# EAGLE design attiny84_3Transistor (EAGLE 7.2.0)
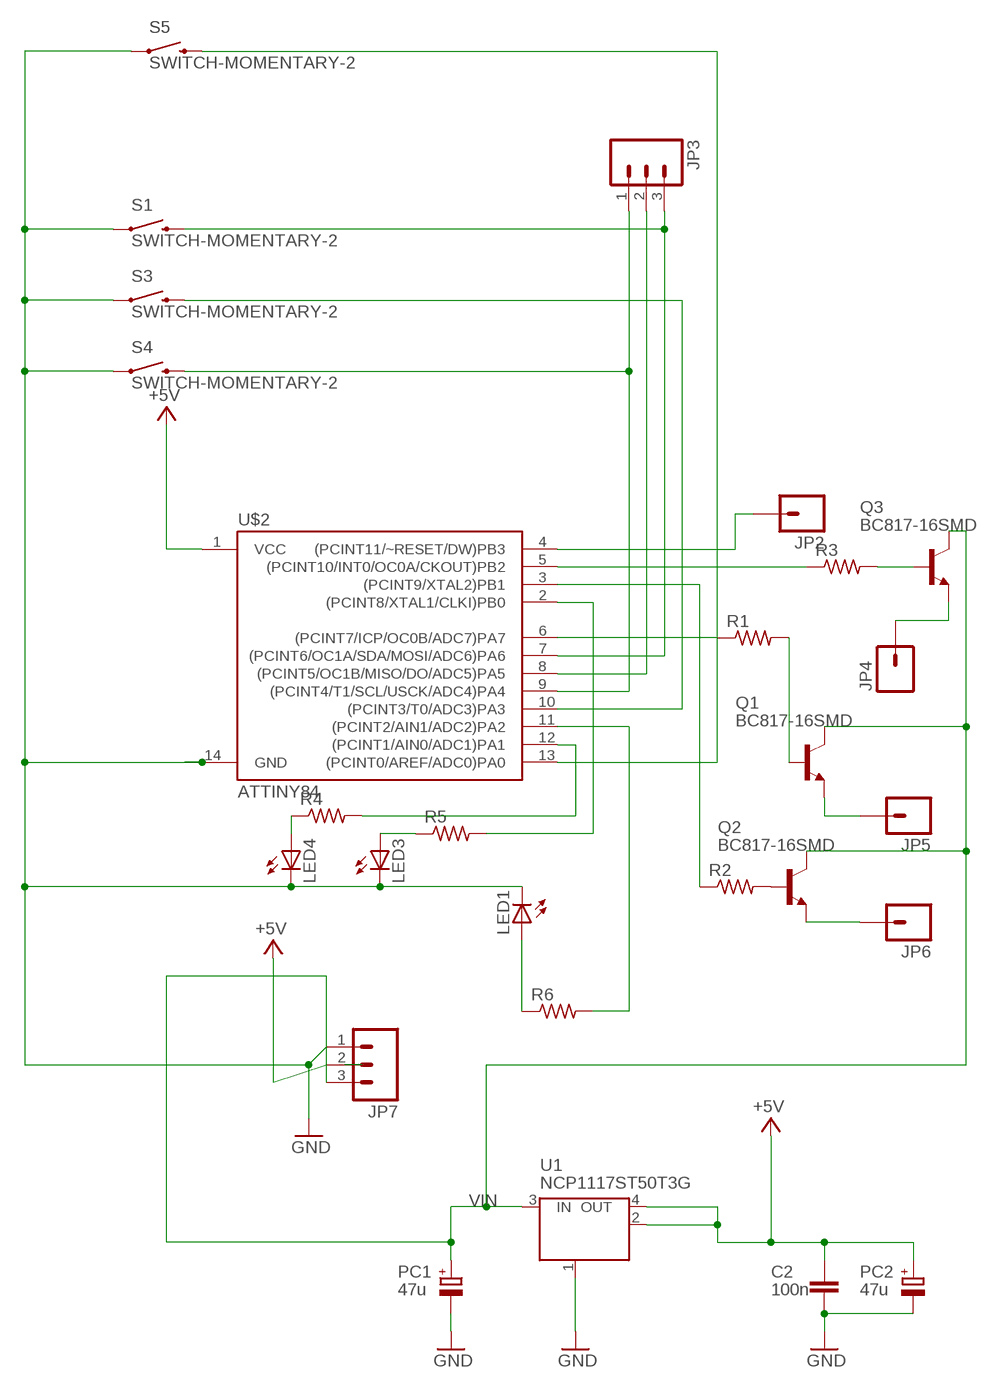
[diagram p0: schematic, sheet 1]

## Parts
C2  100n  C-EU0603-RND  [C0603-ROUND]
JP2  M01NOSILK-KIT  [1X01NS-KIT]
JP3  M031X03_NO_SILK  [1X03_NO_SILK]
JP4  M01NOSILK-KIT  [1X01NS-KIT]
JP5  M01NOSILK-KIT  [1X01NS-KIT]
JP6  M01NOSILK-KIT  [1X01NS-KIT]
JP7  M031X03_NO_SILK  [1X03_NO_SILK]
LED1  LEDCHIPLED_0805  [CHIPLED_0805]
LED3  LEDCHIPLED_0805  [CHIPLED_0805]
LED4  LEDCHIPLED_0805  [CHIPLED_0805]
PC1  47u  CPOL-EUE2.5-5V  [E2,5-4R]
PC2  47u  CPOL-EUE2.5-5V  [E2,5-4R]
Q1  BC817-16SMD  [SOT23-BEC]
Q2  BC817-16SMD  [SOT23-BEC]
Q3  BC817-16SMD  [SOT23-BEC]
R1  R-US_M0805  [M0805]
R2  R-US_M0805  [M0805]
R3  R-US_M0805  [M0805]
R4  R-US_M0805  [M0805]
R5  R-US_M0805  [M0805]
R6  R-US_M0805  [M0805]
S1  SWITCH-MOMENTARY-2  [TACTILE_FSM4JSMATR]
S3  SWITCH-MOMENTARY-2  [TACTILE_FSM4JSMATR]
S4  SWITCH-MOMENTARY-2  [TACTILE_FSM4JSMATR]
S5  SWITCH-MOMENTARY-2  [TACTILE_FSM4JSMATR]
U1  NCP1117ST50T3G  MC33269ST-3.3T3  [SOT223]
U$2  ATTINY84  [SO14]

## Nets
+5V [usbvcc]: C2.2 JP7.2 PC2.+ U1.2(OUT) U1.4(OUT) U$2.1(VCC)
GND: C2.1 JP7.1 LED1.C LED3.C LED4.C PC1.- PC2.- S1.P$1 S1.P$2 S3.P$1 S3.P$2 S4.P$1 S4.P$2 S5.P$1 S5.P$2 U1.1(GND/ADJ) U$2.14(GND)
N$1: JP3.2 U$2.8((PCINT5/OC1B/MISO/DO/ADC5)PA5)
N$2: JP2.1 U$2.4((PCINT11/~RESET/DW)PB3)
N$3: JP3.1 S4.P$3 S4.P$4 U$2.9((PCINT4/T1/SCL/USCK/ADC4)PA4)
N$4: Q1.B R1.2
N$5: JP3.3 S1.P$3 S1.P$4 U$2.7((PCINT6/OC1A/SDA/MOSI/ADC6)PA6)
N$6: Q2.B R2.2
N$7: Q3.B R3.2
N$8: S5.P$3 S5.P$4 U$2.13((PCINT0/AREF/ADC0)PA0)
N$9: R1.1 U$2.6((PCINT7/ICP/OC0B/ADC7)PA7)
N$10: R3.1 U$2.5((PCINT10/INT0/OC0A/CKOUT)PB2)
N$11: R2.1 U$2.3((PCINT9/XTAL2)PB1)
N$12: S3.P$3 S3.P$4 U$2.10((PCINT3/T0/ADC3)PA3)
N$13: R6.2 U$2.11((PCINT2/AIN1/ADC2)PA2)
N$14: JP5.1 Q1.E
N$15: JP4.1 Q3.E
N$17: JP6.1 Q2.E
N$18: R4.2 U$2.12((PCINT1/AIN0/ADC1)PA1)
N$19: R5.2 U$2.2((PCINT8/XTAL1/CLKI)PB0)
N$21: LED4.A R4.1
N$22: LED1.A R6.1
N$24: LED3.A R5.1
VIN [power]: JP7.3 PC1.+ Q1.C Q2.C Q3.C U1.3(IN)

## Library data of the parts
C2 = SmartPrj:C-EU: CAPACITOR, European symbol
JP2 JP4-JP6 = SparkFun-Connectors:M01: Header 1 Standard 1-pin 0.1" header. Use with straight break away headers (SKU : PRT-00116), right angle break away headers (PRT-00553), swiss pins (PRT-00743), machine pins (PRT-00117), and female headers (PRT-00115).
JP3 JP7 = SparkFun-Connectors:M03: Header 3 Standard 3-pin 0.1" header. Use with straight break away headers (SKU : PRT-00116), right angle break away headers (PRT-00553), swiss pins (PRT-00743), machine pins (PRT-00117), and female headers (PRT-00115). Molex polarized connector foot print use with SKU : PRT-08232 with associated crimp pins and housings.
LED1 LED3 LED4 = led:LED: LED OSRAM: - CHIPLED LG R971, LG N971, LY N971, LG Q971, LY Q971, LO R971, LY R971 LH N974, LH R974 LS Q976, LO Q976, LY Q976 LO Q996 - Hyper CHIPLED LW Q18S LB Q993, LB Q99A, LB R99A - SideLED LS A670, LO A670, LY A670, LG A670, LP A670 LB A673, LV A673, LT A673, LW A673 LH A674 LY A675 LS A676, LA A676, LO A676, LY A676, LW A676 LS A679, LY A679, LG A679 - Hyper Micro SIDELED® LS Y876, LA Y876, LO Y876, LY Y876 LT Y87S - SmartLED LW L88C, LW L88S LB L89C, LB L89S, LG L890 LS L89K, LO L89K, LY L89K LS L896, LA L896, LO L896, LY L896 - TOPLED LS T670, LO T670, LY T670, LG T670, LP T670 LSG T670, LSP T670, LSY T670, LOP T670, LYG T670 LG T671, LOG T671, LSG T671 LB T673, LV T673, LT T673, LW T673 LH T674 LS T676, LA T676, LO T676, LY T676, LB T676, LH T676, LSB T676, LW T676 LB T67C, LV T67C, LT T67C, LS T67K, LO T67K, LY T67K, LW E67C LS E67B, LA E67B, LO E67B, LY E67B, LB E67C, LV E67C, LT E67C LW T67C LS T679, LY T679, LG T679 LS T770, LO T770, LY T770, LG T770, LP T770 LB T773, LV T773, LT T773, LW T773 LH T774 LS E675, LA E675, LY E675, LS T675 LS T776, LA T776, LO T776, LY T776, LB T776 LHGB T686 LT T68C, LB T68C - Hyper Mini TOPLED® LB M676 - Mini TOPLED Santana® LG M470 LS M47K, LO M47K, LY M47K Source: http://www.osram.convergy.de LUXEON: - LUMILED® LXK2-PW12-R00, LXK2-PW12-S00, LXK2-PW14-U00, LXK2-PW14-V00 LXK2-PM12-R00, LXK2-PM12-S00, LXK2-PM14-U00 LXK2-PE12-Q00, LXK2-PE12-R00, LXK2-PE12-S00, LXK2-PE14-T00, LXK2-PE14-U00 LXK2-PB12-K00, LXK2-PB12-L00, LXK2-PB12-M00, LXK2-PB14-N00, LXK2-PB14-P00, LXK2-PB14-Q00 LXK2-PR12-L00, LXK2-PR12-M00, LXK2-PR14-Q00, LXK2-PR14-R00 LXK2-PD12-Q00, LXK2-PD12-R00, LXK2-PD12-S00 LXK2-PH12-R00, LXK2-PH12-S00 LXK2-PL12-P00, LXK2-PL12-Q00, LXK2-PL12-R00 Source: www.luxeon.com KINGBRIGHT: KA-3528ASYC Source: www.kingbright.com
PC1 PC2 = rcl:CPOL-EU: POLARIZED CAPACITOR, European symbol
Q1-Q3 = transistor-npn:BC817*: NPN Transistor
R1-R6 = adafruit:R-US_: RESISTOR, American symbol
S1 S3-S5 = SparkFun-Electromechanical_alr:SWITCH-MOMENTARY-2: Various NO switches- pushbuttons, reed, etc
U1 = linear:MC33269ST*: Adjustable Output Low Dropout Voltage Regulator 800 mA Source: http://www.onsemi.com/pub/Collateral/MC33269-D.PDF
U$2 = SparkFun-DigitalIC:ATTINY84: Atmel 14-pin 2/4/8kB flash uC; PROD_ID: IC-11285

## Net classes
1 power: width 0.61 mm, drill 0.61 mm, clearance 0.254 mm
2 gnd: width 0.305 mm, drill 0.559 mm, clearance 0.254 mm
3 usbvcc: width 0.508 mm, drill 0.61 mm, clearance 0.254 mm

## Board
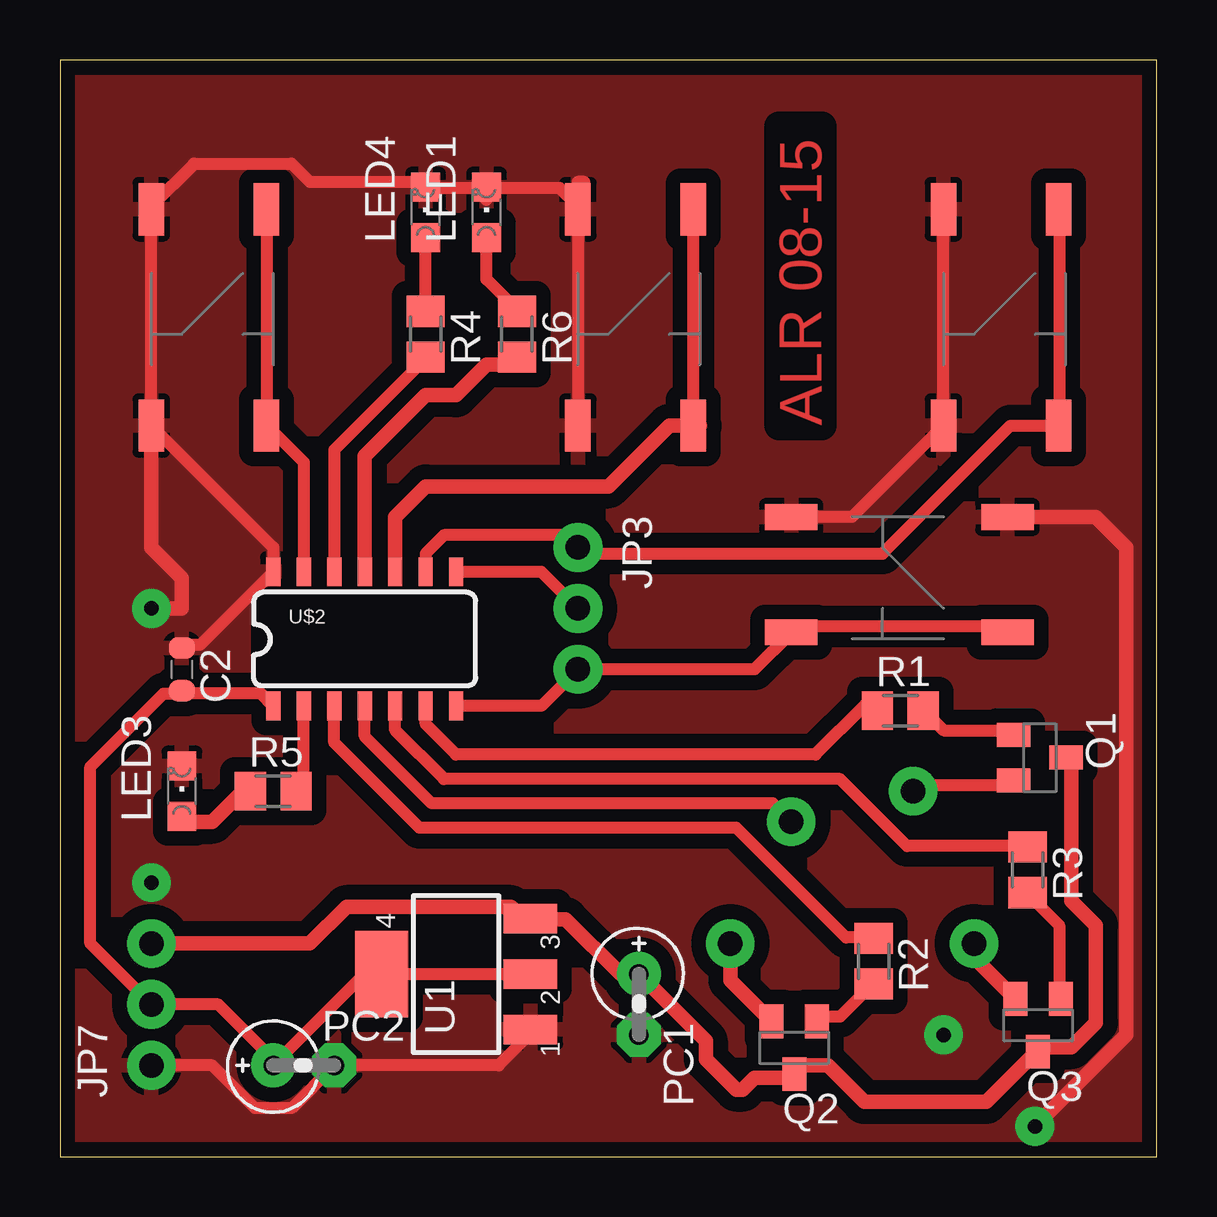
[diagram p1: board, top side]
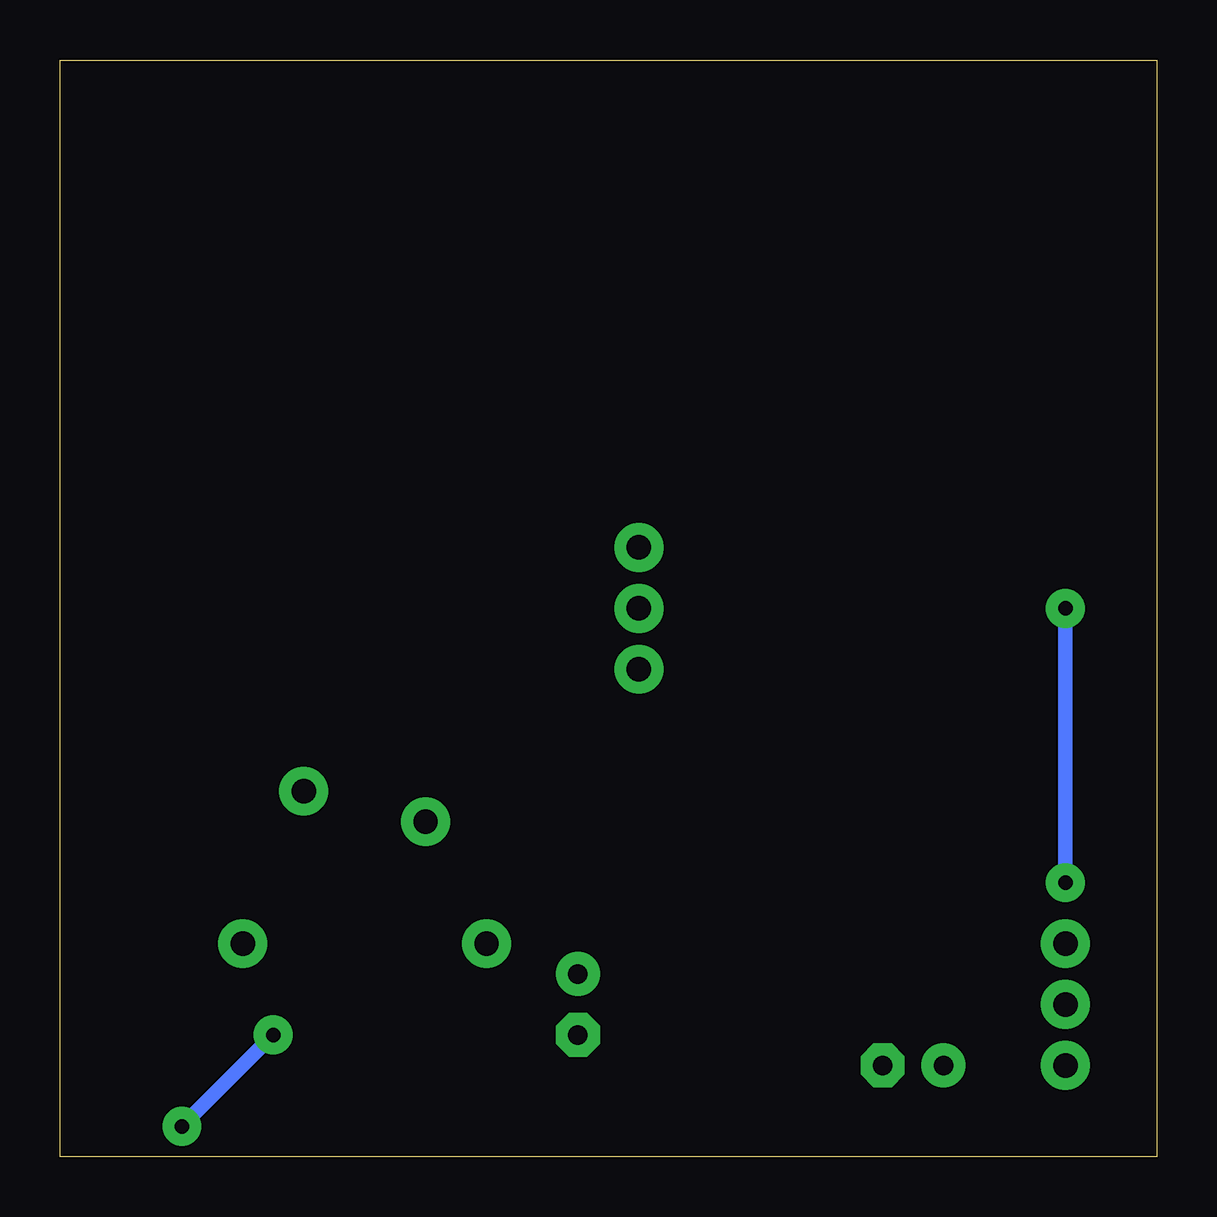
[diagram p2: board, bottom side, seen from below]

Size 45.72 x 45.72 mm. Coordinates in mm from the lower left corner, seen from the top.
Outline: 0,0 45.72,0 45.72,45.72 0,45.72 0,0
Copper layers (1*16): Top 0.035mm / dielectric 1.5mm / Bottom 0.035mm
Design rules "SparkFun2 *": minimum track width 20mil, minimum drill 20mil, track to track 20mil, track to pad 20mil, pad to pad 20mil, via to via 20mil, smd to smd 8mil, copper to edge 10mil, drill to drill 8mil, minimum pad ring 20mil, minimum via ring 20mil, stop-mask expansion 5mil, vias tented up to drill 25mil, thermal gap 10mil
tRestrict: area 8.9,20.3 to 16.5,22.9

### Footprints (pad centres in the part's own frame; a part is rotated, then mirrored left to right if it is on the bottom)
C0603-ROUND = smd 0.898 x 1.1: 1 -0.889,0; 2 0.889,0
1X01NS-KIT = drill 1.016 pad 1.88: 1 0,0
1X03_NO_SILK = drill 1.016 pad 1.88: 1 0,0; 2 2.54,0; 3 5.08,0
CHIPLED_0805 = smd 1.2 x 1.2: A 0,-1.05; C 0,1.05
E2,5-4R = drill 0.813 pad 1.6: + -1.27,0 | drill 0.813 pad 1.6 octagon: - 1.27,0
SOT23-BEC = smd 1 x 1.4: B -0.95,-1.1; C 0,1.1; E 0.95,-1.1
M0805 = smd 1.3 x 1.6: 1 -0.95,0; 2 0.95,0
TACTILE_FSM4JSMATR = smd 1.067 x 2.184: P$1 0,0; P$2 0,9.017; P$3 4.801,9.017; P$4 4.801,0
SOT223 = smd 1.219 x 2.235: 1 -2.311,-3.099; 2 0,-3.099; 3 2.311,-3.099 | smd 3.6 x 2.2: 4 0,3.099
SO14 = smd 0.6 x 1.2: 1 -3.81,-2.8; 2 -2.54,-2.8; 3 -1.27,-2.8; 4 0,-2.8; 5 1.27,-2.8; 6 2.54,-2.8; 7 3.81,-2.8; 8 3.81,2.8; 9 2.54,2.8; 10 1.27,2.8; 11 0,2.8; 12 -1.27,2.8; 13 -2.54,2.8; 14 -3.81,2.8

### Placement (x,y rotation side)
C2  5.08,20.32 270 top
JP2  30.48,13.97 0 top
JP3  21.59,25.4 270 top
JP4  38.1,8.89 0 top
JP5  35.56,15.24 0 top
JP6  27.94,8.89 0 top
JP7  3.81,3.81 90 top
LED1  17.78,39.37 0 top
LED3  5.08,15.24 0 top
LED4  15.24,39.37 0 top
PC1  24.13,6.35 270 top
PC2  10.16,3.81 0 top
Q1  40.84,16.64 270 top
Q2  30.61,4.55 180 top
Q3  40.77,5.49 180 top
R1  35.03,18.59 0 top
R2  33.91,8.15 270 top
R3  40.34,11.96 270 top
R4  15.24,34.29 270 top
R5  8.89,15.24 0 top
R6  19.05,34.29 270 top
S1  30.48,26.67 270 top
S3  21.59,30.48 0 top
S4  36.83,30.48 0 top
S5  3.81,30.48 0 top
U1  16.51,7.62 90 top
U$2  12.7,21.59 0 top

### Tracks (layer width: path | path; a pad name or v marks a point on that pad's centre or on a via)
+5V
  Top 0.508: 5.08,19.3 8.38,19.3 U$2.1 | 5.08,19.3 4.32,19.3 1.27,16.26 1.27,8.89 JP7.2 6.6,6.35 8.89,4.06 PC2.+ 12.7,7.62 U1.4 U1.2 | 5.08,19.3 C2.2
GND  (via drill 0.6)
  Top 0.508: S1.P$1 33.02,26.67 S4.P$1 S4.P$2 | 17.78,40.39 15.24,40.39 LED4.C 15.24,40.64 10.41,40.64 9.65,41.4 5.59,41.4 3.81,39.62 S5.P$2 | 17.78,40.39 20.83,40.39 21.59,39.62 S3.P$2 | S3.P$2 S3.P$1 | S5.P$2 S5.P$1 8.89,25.4 U$2.14 5.84,21.34 5.08,21.34 C2.1 | U1.1 19.56,5.08 18.29,3.81 PC2.- 9.65,2.03 8.13,2.03 6.35,3.81 JP7.1 | 17.78,39.88 17.78,40.39 | 17.78,40.39 LED1.C | 21.84,40.64 21.59,40.64 | S3.P$2 21.84,40.39 21.59,40.39 | S5.P$2 4.06,39.62 S5.P$2
  Top 0.61: S5.P$1 3.81,25.4 5.08,24.13 5.08,22.86 v3.81,22.86 | v40.64,1.27 44.45,5.08 44.45,25.4 43.18,26.67 S1.P$2 39.37,26.67
  Bottom 0.61: v3.81,11.43 v3.81,22.86 | v36.83,5.08 v40.64,1.27
  pour Top (isolate 0.61): -2.54,46.99 48.26,46.99 49.53,-3.81 -1.27,-3.81
N$1
  Top 0.508: JP3.2 20.07,24.38 U$2.8
N$2
  Top 0.508: U$2.4 12.7,17.53 15.49,14.73 29.72,14.73 JP2.1
  Top 0.61: 12.7,19.05 U$2.4
N$3
  Top 0.508: S4.P$3 41.66,39.37 41.66,30.48 S4.P$4 39.62,30.48 34.29,25.15 21.84,25.15 JP3.1 21.08,25.91 16,25.91 15.24,25.15 U$2.9
N$4
  Top 0.508: Q1.B 39.62,17.78 36.83,17.78 36.07,18.54 R1.2
N$5
  Top 0.508: U$2.7 20.07,18.8 JP3.3 28.96,20.32 30.48,21.84 S1.P$4 30.48,22.1 39.37,22.1 S1.P$3
N$6
  Top 0.508: Q2.B 31.75,5.84 32.51,5.84 33.78,7.11 R2.2
N$7
  Top 0.508: Q3.B 41.66,6.6 41.66,9.65 40.39,10.92 R3.2
N$8
  Top 0.508: U$2.13 10.16,28.96 8.64,30.48 | 8.64,30.48 8.64,39.37 S5.P$3 | 8.64,30.48 S5.P$4
N$9
  Top 0.508: U$2.6 15.24,18.03 16.51,16.76 31.5,16.76 33.53,18.8 34.04,18.8 R1.1
  Top 0.61: 15.24,19.05 U$2.6
N$10
  Top 0.508: U$2.5 13.97,17.78 16,15.75 32.51,15.75 35.31,12.95 40.13,12.95 R3.1
  Top 0.61: 13.97,19.05 U$2.5
N$11
  Top 0.508: U$2.3 11.43,17.27 14.99,13.72 28.19,13.72 32.77,9.14 33.78,9.14 R2.1
  Top 0.61: 11.43,19.05 U$2.3
N$12
  Top 0.508: S3.P$3 26.42,39.37 26.42,30.48 S3.P$4
  Top 0.61: 13.97,24.13 U$2.10 13.97,26.67 15.24,27.94 22.86,27.94 25.4,30.48 S3.P$4 26.67,30.48
N$13
  Top 0.61: 12.7,24.13 U$2.11 12.7,29.21 15.24,31.75 16.51,31.75 17.78,33.02 19.05,33.02 R6.2
N$14
  Top 0.508: JP5.1 35.81,15.49 39.62,15.49 Q1.E
N$15
  Top 0.61: Q3.E 38.1,8.3 JP4.1
N$17
  Top 0.61: Q2.E 27.94,7.36 JP6.1
N$18
  Top 0.508: U$2.12 11.43,29.46 15.24,33.27 R4.2
N$19
  Top 0.508: U$2.2 10.16,15.49 9.91,15.24 R5.2
N$21
  Top 0.508: R4.1 LED4.A
N$22
  Top 0.508: LED1.A 17.78,36.58 19.05,35.31 R6.1
N$24
  Top 0.61: R5.1 7.62,15.24 6.35,13.97 5.08,13.97 LED3.A
VIN
  Top 0.61: JP7.3 10.41,8.89 11.94,10.41 18.8,10.41 19.3,9.91 U1.3 19.81,9.91 21.08,9.91 23.37,7.62 PC1.+ 26.92,4.83 26.92,4.06 28.19,2.79 28.45,2.79 28.96,3.3 30.48,3.3 Q2.C 30.48,3.56 30.73,3.81 32,3.81 33.53,2.29 38.61,2.29 40.64,4.32 Q3.C 40.89,4.57 42.16,4.57 43.18,5.59 43.18,9.65 42.16,10.67 42.16,16.51 Q1.C

### Text on the board
Top: ALR 08-15